# Altium project ad_via.PrjPcb
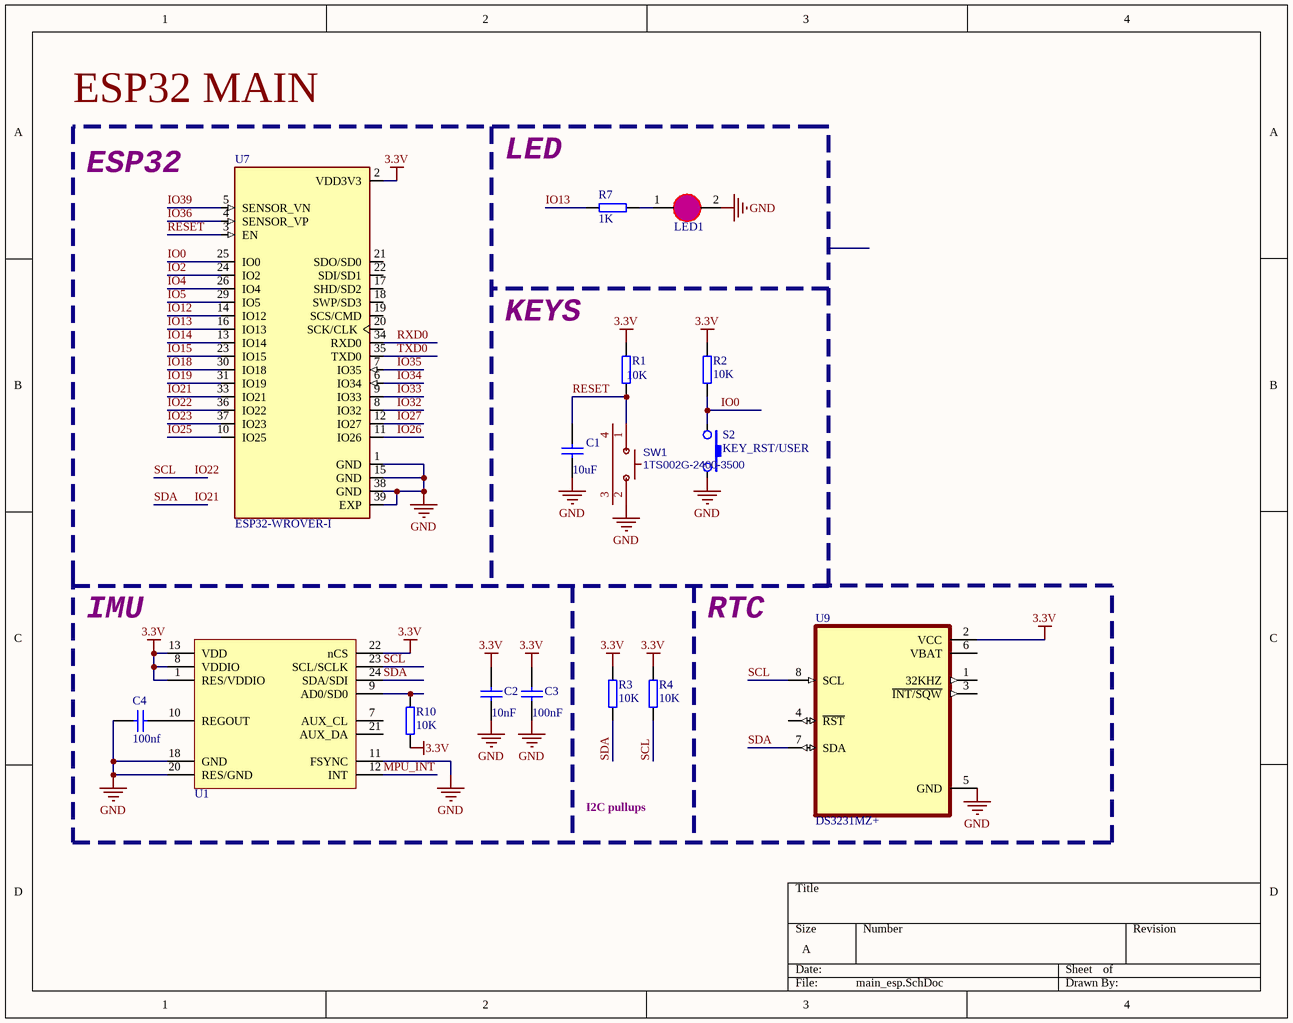
[diagram p0: main_esp.SchDoc]
3 sheets, 29 parts. Net scope: global (net labels, ports and power ports of the same name join across sheets).
Board file: VIA6.1.PcbDoc
Sheets:
  main_esp.SchDoc
  CONNECTROS.SchDoc
  Mic_SPK2.SchDoc

## Sheet main_esp.SchDoc
size A

### Parts
C1  value 10uF  [SMT0603]  (hidden comment: Cap Semi)
C2  value 10nF  [SMT0603]  (hidden comment: Cap Semi)
C3  value 100nF  [SMT0603]  (hidden comment: Cap Semi)
C4  value 100nf  [SMT0603]  (hidden comment: Cap Semi)
LED1  LED3  [LED0805]  (value not drawn)
R1  value 10K  [SMT0603]  (hidden comment: Resistor)
R2  value 10K  [SMT0603]  (hidden comment: Resistor)
R3  value 10K  [SMT0603]  (hidden comment: Resistor)
R4  value 10K  [SMT0603]  (hidden comment: Resistor)
R7  value 1K  [SMT0603]  (hidden comment: Resistor)
R10  value 10K  [SMT0603]  (hidden comment: Resistor)
S2  KEY_RST/USER  [SMT_SW_PTS_820]
SW1  1TS002G-2400-3500  [KEY-SMD_1TS002G]
U1  MPU-9250  [QFN40P300X300X105_HS-25L]  (value not drawn)
U7  ESP32-WROVER-I  [XCVR_ESP32-WROVER-I]
U9  DS3231MZ+  [SOIC127P600X175-8N]

### Blocks framed on the sheet
ESP32 MAIN: C1 LED1 R1 R2 R7 S2 SW1 U7

### Nets
3.3V: C2.2 C3.2 R1.2 R2.2 R3.2 R4.2 R10.1 U1.1(RES/VDDIO) U1.8(VDDIO) U1.13(VDD) U1.22(nCS) U7.2(VDD3V3) U9.2(VCC)
GND: C1.1 C2.1 C3.1 C4.2 LED1.2(K) S2.2 SW1.2 U1.11(FSYNC) U1.18(GND) U1.20(RES/GND) U7.1(GND) U7.15(GND) U7.38(GND) U7.39(EXP) U9.5(GND)
IO0: R2.1 S2.1 U7.25(IO0)
IO2: U7.24(IO2)
IO4: U7.26(IO4)  [project net I2S_DIN]
IO5: U7.29(IO5)
IO12: U7.14(IO12)
IO13: R7.1 U7.16(IO13)
IO14: U7.13(IO14)
IO15: U7.23(IO15)
IO18: U7.30(IO18)
IO19: U7.31(IO19)
IO21: R3.1 U1.24(SDA/SDI) U7.33(IO21) U9.7(SDA)  [also labelled SDA]
IO22: R4.1 U1.23(SCL/SCLK) U7.36(IO22) U9.8(SCL)  [also labelled SCL]
IO23: U7.37(IO23)
IO25: U7.10(IO25)
IO26: U7.11(IO26)  [project net BCLK]
IO27: U7.12(IO27)
IO32: U7.8(IO32)
IO33: U7.9(IO33)  [project net I2S_DOUT]
IO34: U7.6(IO34)
IO35: U7.7(IO35)
IO36: U7.4(SENSOR_VP)
IO39: U7.5(SENSOR_VN)
MPU_INT: U1.12(INT)
RESET: C1.2 R1.1 SW1.1 U7.3(EN)
RXD0: U7.34(RXD0)
TXD0: U7.35(TXD0)
NetC4_1: C4.1 U1.10(REGOUT)
NetLED1_1: LED1.1(A) R7.2
NetR10_2: R10.2 U1.9(AD0/SD0)

Not connected (* = marked no-connect by the designer): SW1 3 4; U1 7(AUX_CL) 21(AUX_DA); U7 17(SHD/SD2) 18(SWP/SD3) 19(SCS/CMD) 20(SCK/CLK) 21(SDO/SD0) 22(SDI/SD1); U9 1(32KHZ) 3(~{INT/SQW}) 4(~{RST}) 6(VBAT)

### Notes on the sheet
- LED
- ESP32
- KEYS
- IMU
- RTC
- I2C pullups

### Library data of the parts
C1 C2 C4 = CAP-SM-0603-X5R-10uF: CAP SM 0603 X5R 10uF 10%; Tolerance: ±10%; Supplier 1: Farnell; Supplier 2: Digi-Key; Supplier Part Number 1: 2366833; Supplier Part Number 2: 490-3896-1-ND
C3 = CAP-SM-0603-X7R-100nF: CAP SM 0603 X7R 100nF 10%; Tolerance: ±10%; Supplier 1: Digi-Key; Supplier 2: Farnell; Supplier Part Number 1: 490-3167-1-ND; Supplier Part Number 2: 1775994RL
LED1 = LED0805: LED SMD 0805
R1-R4 R10 = RES-SM-0603-10K: RES SM 0603 10K; Supplier 1: Farnell; Supplier 2: Digi-Key; Supplier Part Number 1: 9330399; Supplier Part Number 2: 541-10.0KHCT-ND
R7 = RES-SM-0603-1K: RES SM 0603 1K
S2 = SMT_SW_PTS_820: SMT Tactile ‎Switch PTS 820 Series
SW1 = 1TS002G-2400-3500: BOM_Manufacturer: HYP; Contributor: LCSC; BOM_Supplier: LCSC; BOM_Supplier Part: C319378; BOM_Manufacturer Part: 1TS002G-2400-3500; spicePre: S; spiceSymbolName: 1TS002G-2400-3500
U7 = ESP32-WROVER-I: Bluetooth, WiFi 802.11b/g/n, Bluetooth v4.2 + EDR, Class 1, 2 and 3 Transceiver Module 2.4GHz ~ 2.5GHz Antenna Not Included, I-PEX Surface Mount; MF: Espressif Systems; Package: Module Espressif Systems; Availability: Unavailable; MP: ESP32-WROVER-I; Value: *; SnapEDA_Link: https://www.snapeda.com/parts/ESP32-WROVER-I/Espressif%20Systems/view-part/2298808/?ref=snap; Price: None
U9 = DS3231MZ+: Real Time Clock _RTC_ IC Clock/Calendar IÂ²C, 2-Wire Serial 8-SOIC _0.154, 3.90mm Width_; MF: Maxim Integrated; MP: DS3231MZ; Price: None; Availability: Unavailable; Package: SOIC-8 Maxim Integrated; SnapEDA_Link: https://www.snapeda.com/parts/DS3231MZ/Maxim%20Integrated/view-part/2834343/?ref=snap; Value: *

## Sheet CONNECTROS.SchDoc
size A
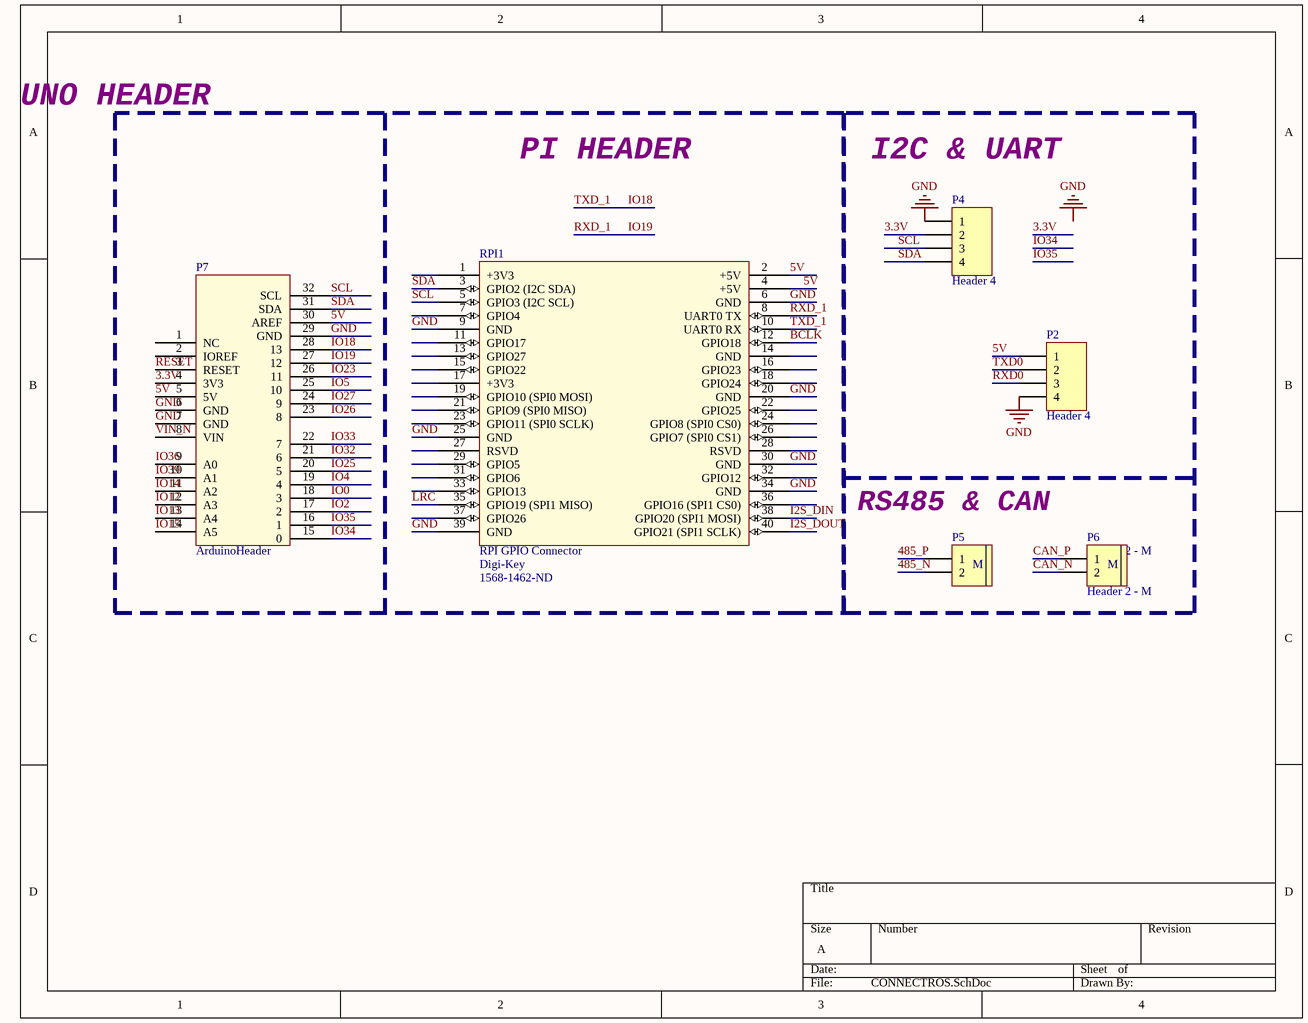
[diagram p1: CONNECTROS.SchDoc]

### Parts
P2  Header 4  [HDR1X4]
P4  Header 4  [CONN-TH_XH2.54-4AW]
P5  Header 2 - M  [Medium - Header 2]
P6  Header 2 - M  [Medium - Header 2]
P7  ArduinoHeader  [ArduinoClone2]
RPI1  RPI GPIO Connector  Supplier 1: Digi-Key  Supplier Part Number 1: 1568-1462-ND  [rpi]

### Blocks framed on the sheet
I2C & UART: P2 P4-P6

### Nets
3.3V: P4.2 P7.4(3V3)
5V: P2.1 P7.5(5V) P7.30(AREF) RPI1.2(+5V) RPI1.4(+5V)
GND: P2.4 P4.1 P7.6(GND) P7.7(GND) P7.29(GND) RPI1.6(GND) RPI1.9(GND) RPI1.20(GND) RPI1.25(GND) RPI1.30(GND) RPI1.34(GND) RPI1.39(GND)
485_N: P5.2
485_P: P5.1
BCLK: P7.23(8) RPI1.12(GPIO18)  [also labelled IO26]
CAN_N: P6.2
CAN_P: P6.1
I2S_DIN: P7.19(4) RPI1.38(GPIO20_(SPI1_MOSI))  [also labelled IO4]
I2S_DOUT: P7.22(7) RPI1.40(GPIO21_(SPI1_SCLK))  [also labelled IO33]
IO0: P7.18(3)
IO2: P7.17(2)
IO5: P7.25(10)
IO12: P7.12(A3)
IO13: P7.13(A4)
IO14: P7.11(A2)
IO15: P7.14(A5)
IO18: P7.28(13) RPI1.10(UART0_RX)  [also labelled TXD_1]
IO19: P7.27(12) RPI1.8(UART0_TX)  [also labelled RXD_1]
IO23: P7.26(11)
IO25: P7.20(5)
IO27: P7.24(9) RPI1.35(GPIO19_(SPI1_MISO))  [also labelled LRC]
IO32: P7.21(6)
IO34: P7.15(0)
IO35: P7.16(1)
IO36: P7.9(A0)
IO39: P7.10(A1)
RESET: P7.3(RESET)
RXD0: P2.3
SCL: P4.3 P7.32(SCL) RPI1.5(GPIO3_(I2C_SCL))  [project net IO22]
SDA: P4.4 P7.31(SDA) RPI1.3(GPIO2_(I2C_SDA))  [project net IO21]
TXD0: P2.2
VIN_N: P7.8(VIN)

Not connected (* = marked no-connect by the designer): P7 1(NC) 2(IOREF); RPI1 1(+3V3) 7(GPIO4) 11(GPIO17) 13(GPIO27) 14(GND) 15(GPIO22) 16(GPIO23) 17(+3V3) 18(GPIO24) 19(GPIO10_(SPI0_MOSI)) 21(GPIO9_(SPI0_MISO)) 22(GPIO25) 23(GPIO11_(SPI0_SCLK)) 24(GPIO8_(SPI0_CS0)) 26(GPIO7_(SPI0_CS1)) 27(RSVD) 28(RSVD) 29(GPIO5) 31(GPIO6) 32(GPIO12) 33(GPIO13) 36(GPIO16_(SPI1_CS0)) 37(GPIO26)

### Notes on the sheet
- UNO HEADER
- PI HEADER
- (near P5) RS485 & CAN
- Labels drawn without touching a wire or pin: GND
- (in symbol Header 2 - M) M

### Library data of the parts
P2 P4 = Header 4: Header, 4-Pin; LatestRevisionDate: 17-Jul-2002; LatestRevisionNote: Re-released for DXP Platform.; Publisher: Altium Limited
P5 P6 = Header 2 - M: Header, 2-Pin, Medium; LatestRevisionDate: 17-Jul-2002; LatestRevisionNote: Re-released for DXP Platform.; Publisher: Altium Limited
RPI1 = rpi connector: GPIO Header for Raspberry Pi A+/B+/Pi 2/Pi 3 - 2x20; Manufacturer: SparkFun Electronics; Manufacturer Part Number: PRT-14017; Nils Minor: author; nilsminor@web.de: mail; RoHS: RoHS Compliant; Category: Development Boards, Kits, Programmers; Stock 1: 150; Pricing 1: 1=1.84 (EUR); Part Status: Active; Accessory Type: Connector; For Use With/Related Products: Raspberry Pi; ComponentLink1URL: https://cdn.sparkfun.com/datasheets/Dev/RaspberryPi/12313.pdf; ComponentLink1Description: https://cdn.sparkfun.com/datasheets/Dev/RaspberryPi/12313.pdf

## Sheet Mic_SPK2.SchDoc
size A
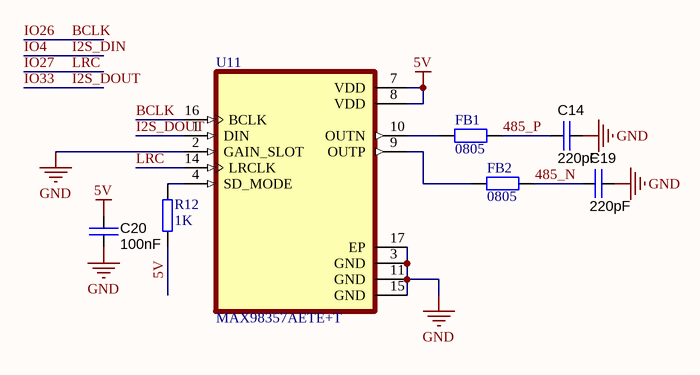
[diagram p2: Mic_SPK2.SchDoc]

### Parts
C14  220pF  [CAPC1608X90N]
C19  220pF  [CAPC1608X90N]
C20  100nF  [CAPC1608X90N]
FB1  value 0805  [DIEN TRO 0805]  (hidden comment: R0805)
FB2  value 0805  [DIEN TRO 0805]  (hidden comment: R0805)
R12  value 1K  [SMT0603]  (hidden comment: Resistor)
U11  MAX98357AETE+T  [QFN50P300X300X80-17N]

### Nets
5V: C20.1 R12.1 U11.7(VDD) U11.8(VDD)
GND: C14.2 C19.2 C20.2 U11.2(GAIN_SLOT) U11.3(GND) U11.11(GND) U11.15(GND) U11.17(EP)
485_N: C19.1 FB2.2
485_P: C14.1 FB1.2
BCLK: U11.16(BCLK)  [also labelled IO26]
I2S_DOUT: U11.1(DIN)  [also labelled IO33]
IO27: U11.14(LRCLK)  [also labelled LRC]
NetFB1_1: FB1.1 U11.10(OUTN)
NetFB2_1: FB2.1 U11.9(OUTP)
NetR12_2: R12.2 U11.4(SD_MODE)

### Library data of the parts
C14 C19 C20 = CAP C_0603: Capacitor SMD Cer 470nF 10% 16V X7R 0603; Manufacturer 1: Murata Electronics North America; Manufacturer Part Number 1: GRM188R71C474KA88D; Ratings: 16V; X7R; Material: ceramic; SCDType: spec; Package / Case: 0603 (1608 metric); Tolerance: ±10%; Manufacturer 2: TDK Corporation; Manufacturer Part Number 2: C1608X7R1C474K; Supplier 1: Digi-Key; Supplier Part Number 1: 490-3295-2-ND; Supplier 2: Digi-Key; Supplier Part Number 2: 445-5192-2-ND; Supplier 3: Digi-Key; Supplier Part Number 3: 587-1250-2-ND; Manufacturer 3: Taiyo Yuden; Manufacturer Part Number 3: EMK107B7474KA-T; Manufacturer 4: Samsung; Manufacturer Part Number 4: CL10B474KONE; ComponentLink1URL: http://psearch.murata.com/capacitor/product/GRM188R71C474KA88#.pdf; ComponentLink1Description: http://psearch.murata.com/capacitor/product/GRM188R71C474KA88#.pdf; ComponentLink2URL: http://product.tdk.com/capacitor/mlcc/en/documents/mlcc_commercial_general_en.pdf; ComponentLink2Description: http://product.tdk.com/capacitor/mlcc/en/documents/mlcc_commercial_general_en.pdf; ComponentLink3URL: http://www.yuden.co.jp/or/product/category/capacitor/EMK107B7474KA-T.pdf; ComponentLink3Description: http://www.yuden.co.jp/or/product/category/capacitor/EMK107B7474KA-T.pdf
  C14 C19: Value: 220pF
  C20: Value: 100nF
FB1 FB2 = R0805: Resistor SMD 0805; Published: 8-Jun-2000; LatestRevisionDate: 17-Jul-2002; LatestRevisionNote: Re-released for DXP Platform.; PackageReference: AXIAL-0.4; Publisher: Altium Limited
R12 = RES-SM-0603-1K: RES SM 0603 1K
U11 = MAX98357AETE+T: Amplifier IC 1-Channel _Mono_ Class D 16-TQFN _3x3_; MF: Maxim Integrated; MP: MAX98357AETE+T; Availability: Unavailable; SnapEDA_Link: https://www.snapeda.com/parts/MAX98357AETE%2BT/Maxim%20Integrated/view-part/48842/?ref=snap; Package: TQFN-16 Maxim; Price: None; Value: *

## Nets that join several sheets
3.3V: main_esp (13 pins), CONNECTROS (P4.2 P7.4)
5V: CONNECTROS (5 pins), Mic_SPK2 (C20.1 R12.1 U11.7 U11.8)
GND: main_esp (15 pins), CONNECTROS (12 pins), Mic_SPK2 (8 pins)
485_N: CONNECTROS (P5.2), Mic_SPK2 (C19.1 FB2.2)
485_P: CONNECTROS (P5.1), Mic_SPK2 (C14.1 FB1.2)
BCLK: main_esp (U7.11), CONNECTROS (P7.23 RPI1.12), Mic_SPK2 (U11.16)
I2S_DIN: main_esp (U7.26), CONNECTROS (P7.19 RPI1.38)
I2S_DOUT: main_esp (U7.9), CONNECTROS (P7.22 RPI1.40), Mic_SPK2 (U11.1)
IO0: main_esp (R2.1 S2.1 U7.25), CONNECTROS (P7.18)
IO2: main_esp (U7.24), CONNECTROS (P7.17)
IO5: main_esp (U7.29), CONNECTROS (P7.25)
IO12: main_esp (U7.14), CONNECTROS (P7.12)
IO13: main_esp (R7.1 U7.16), CONNECTROS (P7.13)
IO14: main_esp (U7.13), CONNECTROS (P7.11)
IO15: main_esp (U7.23), CONNECTROS (P7.14)
IO18: main_esp (U7.30), CONNECTROS (P7.28 RPI1.10)
IO19: main_esp (U7.31), CONNECTROS (P7.27 RPI1.8)
IO21: main_esp (R3.1 U1.24 U7.33 U9.7), CONNECTROS (P4.4 P7.31 RPI1.3)
IO22: main_esp (R4.1 U1.23 U7.36 U9.8), CONNECTROS (P4.3 P7.32 RPI1.5)
IO23: main_esp (U7.37), CONNECTROS (P7.26)
IO25: main_esp (U7.10), CONNECTROS (P7.20)
IO27: main_esp (U7.12), CONNECTROS (P7.24 RPI1.35), Mic_SPK2 (U11.14)
IO32: main_esp (U7.8), CONNECTROS (P7.21)
IO34: main_esp (U7.6), CONNECTROS (P7.15)
IO35: main_esp (U7.7), CONNECTROS (P7.16)
IO36: main_esp (U7.4), CONNECTROS (P7.9)
IO39: main_esp (U7.5), CONNECTROS (P7.10)
RESET: main_esp (C1.2 R1.1 SW1.1 U7.3), CONNECTROS (P7.3)
RXD0: main_esp (U7.34), CONNECTROS (P2.3)
TXD0: main_esp (U7.35), CONNECTROS (P2.2)